# EAGLE design Main board (EAGLE 7.4.0)
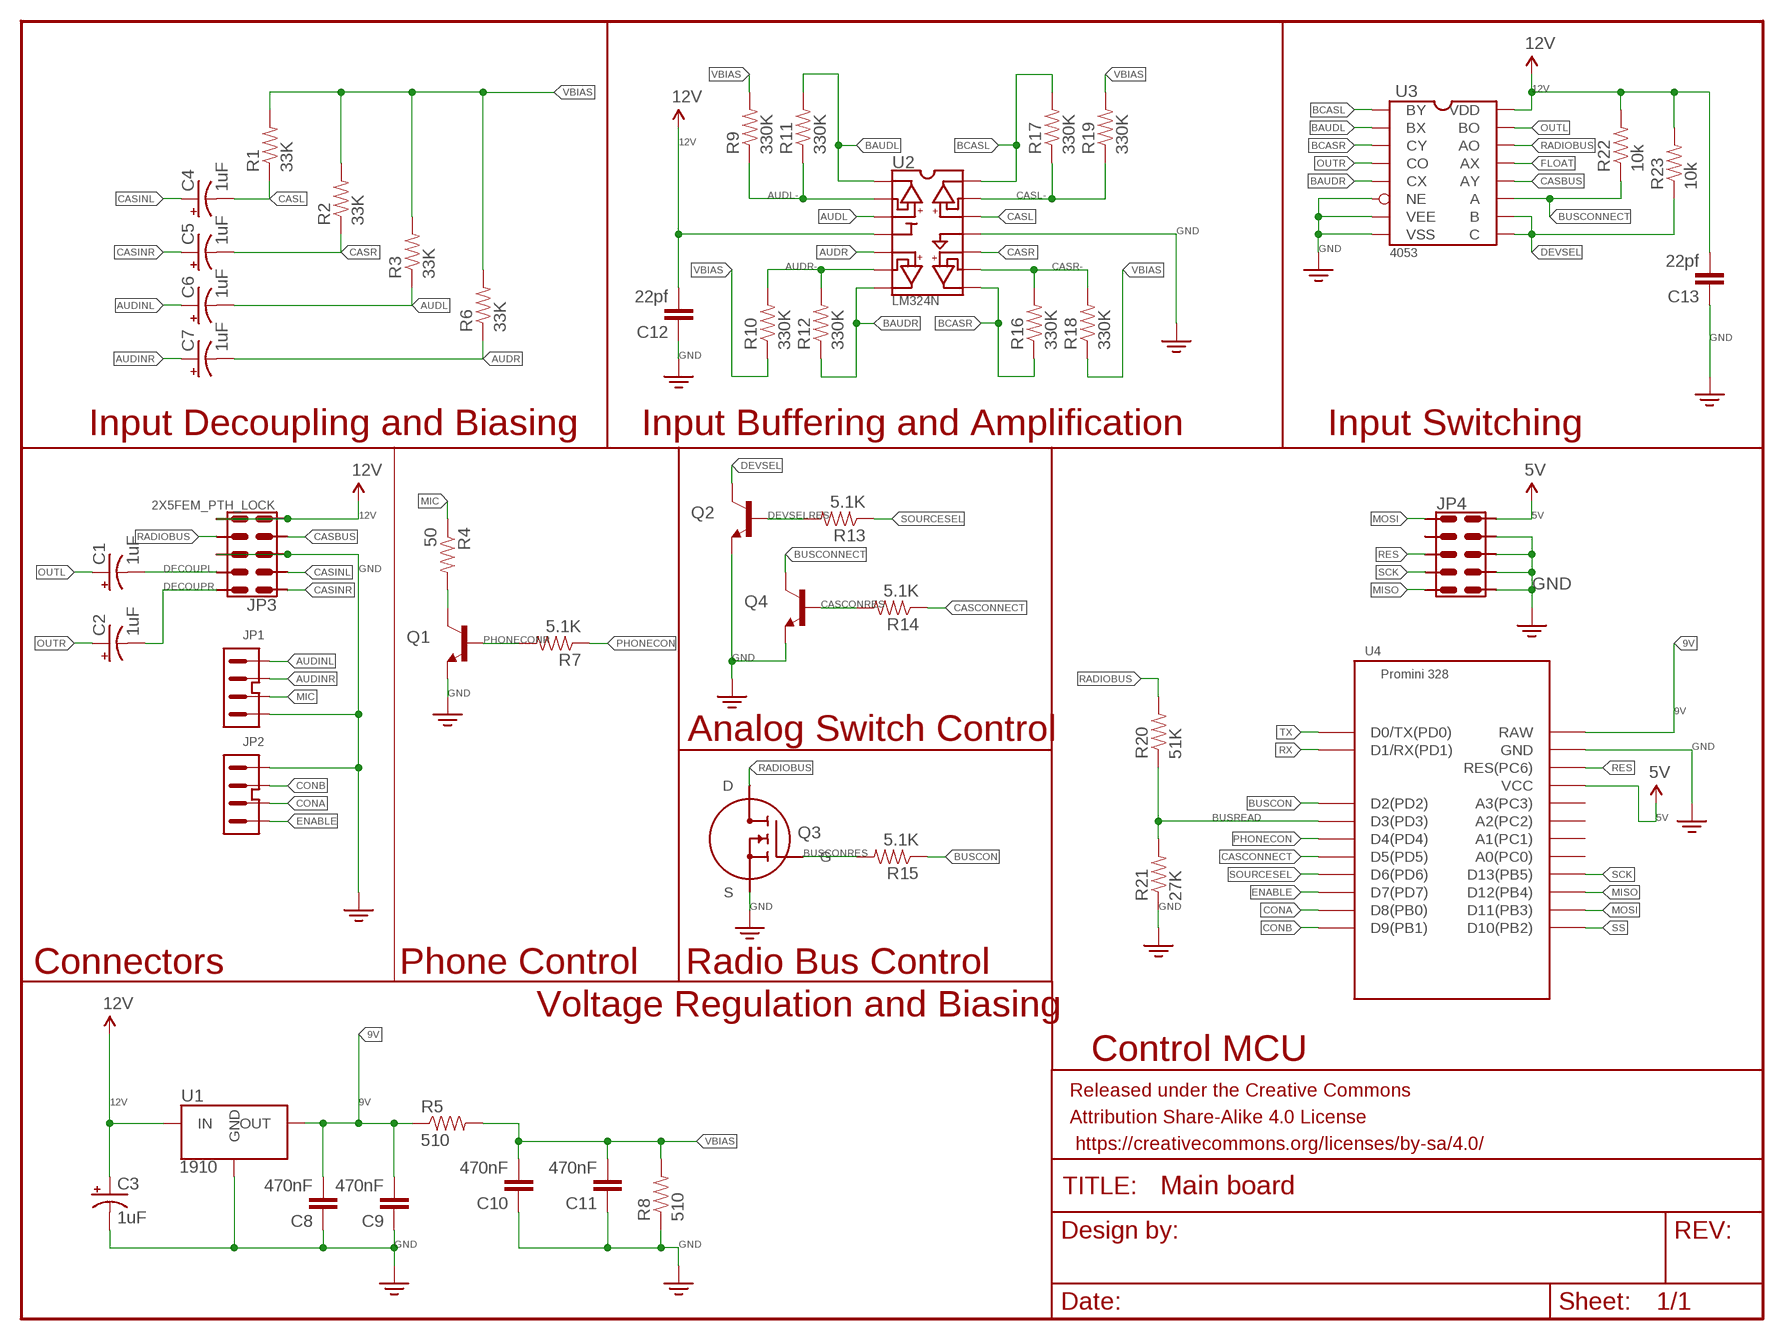
[diagram p0: schematic, sheet 1]

## Parts
C1  1uF  CAP_POLPTH2  [CPOL-RADIAL-10UF-25V]
C2  1uF  CAP_POLPTH2  [CPOL-RADIAL-10UF-25V]
C3  1uF  CAP_POLPTH2  [CPOL-RADIAL-10UF-25V]
C4  1uF  CAP_POLPTH2  [CPOL-RADIAL-10UF-25V]
C5  1uF  CAP_POLPTH2  [CPOL-RADIAL-10UF-25V]
C6  1uF  CAP_POLPTH2  [CPOL-RADIAL-10UF-25V]
C7  1uF  CAP_POLPTH2  [CPOL-RADIAL-10UF-25V]
C8  470nF  CAP0603-CAP  [0603-CAP]
C9  470nF  CAP0603-CAP  [0603-CAP]
C10  470nF  CAP0603-CAP  [0603-CAP]
C11  470nF  CAP0603-CAP  [0603-CAP]
C12  22pf  CAP0603-CAP  [0603-CAP]
C13  22pf  CAP0603-CAP  [0603-CAP]
FRAME1  FRAME-LETTERNO_PACKAGE  [DUMMY]
JP1  4PINJST  [JST-4-PTH-VERT]
JP2  4PINJST  [JST-4-PTH-VERT]
JP3  2X5FEM_PTH_LOCK  [2X5PTHFEMLOCK]
JP4  2X5FEM_PTH_LOCK  [2X5PTHFEMLOCK]
Q1  TRANSISTOR_NPNTO-92-AMMO  [TO-92-AMMO]
Q2  TRANSISTOR_NPNTO-92-AMMO  [TO-92-AMMO]
Q3  BUZ101S  [TO-220]
Q4  TRANSISTOR_NPNTO-92-AMMO  [TO-92-AMMO]
R1  33K  RESISTOR0603  [0603-RES]
R2  33K  RESISTOR0603  [0603-RES]
R3  33K  RESISTOR0603  [0603-RES]
R4  50  RESISTOR0603  [0603-RES]
R5  510  RESISTOR0603  [0603-RES]
R6  33K  RESISTOR0603  [0603-RES]
R7  5.1K  RESISTOR0603  [0603-RES]
R8  510  RESISTOR0603  [0603-RES]
R9  330K  RESISTOR0603  [0603-RES]
R10  330K  RESISTOR0603  [0603-RES]
R11  330K  RESISTOR0603  [0603-RES]
R12  330K  RESISTOR0603  [0603-RES]
R13  5.1K  RESISTOR0603  [0603-RES]
R14  5.1K  RESISTOR0603  [0603-RES]
R15  5.1K  RESISTOR0603  [0603-RES]
R16  330K  RESISTOR0603  [0603-RES]
R17  330K  RESISTOR0603  [0603-RES]
R18  330K  RESISTOR0603  [0603-RES]
R19  330K  RESISTOR0603  [0603-RES]
R20  51K  RESISTOR0603  [0603-RES]
R21  27K  RESISTOR0603  [0603-RES]
R22  10k  RESISTOR0603  [0603-RES]
R23  10k  RESISTOR0603  [0603-RES]
U1  1910  [TO-220]
U2  LM324N  [DIP14]
U3  4053  [DIP16]
U4  PROMINIV2NOFTDI  [PROMINIV2NOFTDI]

## Nets
5V: JP4.P$10 U4.VCC
9V: C8.2 C9.2 R5.1 U1.3(OUT) U4.RAW
12V: C3.1(+) C12.2 C13.2 JP3.P$5 JP3.P$6 R22.2 R23.2 U1.1(IN) U2.P$4(VCC) U3.P$16(VDD)
AUDINL: C6.1(+) JP1.1
AUDINR: C7.1(+) JP1.2
AUDL: C6.2(-) R3.1 U2.P$3(A+)
AUDL-: R9.1 R11.1 U2.P$2(A-)
AUDR: C7.2(-) R6.1 U2.P$5(B+)
AUDR-: R10.2 R12.2 U2.P$6(B-)
BAUDL: R11.2 U2.P$1(AO) U3.P$2(BX)
BAUDR: R12.1 U2.P$7(BO) U3.P$5(CX)
BCASL: R17.2 U2.P$14(DO) U3.P$1(BY)
BCASR: R16.1 U2.P$8(CO) U3.P$3(CY)
BUSCON: R15.1 U4.D2(D2(PD2))
BUSCONNECT: Q4.3(C) R22.1 U3.P$11(A)
BUSCONRES: Q3.1(G) R15.2
BUSREAD: R20.1 R21.2 U4.D3(D3(PD3))
CASBUS: JP3.P$4 U3.P$12(AY)
CASCONNECT: R14.1 U4.D5(D5(PD5))
CASCONRES: Q4.2(B) R14.2
CASINL: C4.1(+) JP3.P$2
CASINR: C5.1(+) JP3.P$1
CASL: C4.2(-) R1.1 U2.P$12(D+)
CASL-: R17.1 R19.1 U2.P$13(D-)
CASR: C5.2(-) R2.1 U2.P$10(C+)
CASR-: R16.2 R18.2 U2.P$9(C-)
CONA: JP2.3 U4.D8(D8(PB0))
CONB: JP2.2 U4.D9(D9(PB1))
DECOUPL: C1.2(-) JP3.P$9
DECOUPR: C2.2(-) JP3.P$10
DEVSEL: Q2.3(C) R23.1 U3.P$9(C) U3.P$10(B)
DEVSELRES: Q2.2(B) R13.2
ENABLE: JP2.4 U4.D7(D7(PD7))
FLOAT: U3.P$13(AX)
GND: C3.2(-) C8.1 C9.1 C10.1 C11.1 C12.1 C13.1 JP1.4 JP2.1 JP3.P$3 JP3.P$8 JP4.P$6 JP4.P$7 JP4.P$8 JP4.P$9 Q1.1(E) Q2.1(E) Q3.3(S) Q4.1(E) R8.1 R21.1 U1.2(GND) U2.P$11(GND) U3.P$6(NE) U3.P$7(VEE) U3.P$8(VSS) U4.GND1(GND) U4.GND3(GND) ; supply symbol labelled GND2
MIC: JP1.3 R4.1
MISO: JP4.P$5 U4.D12(D12(PB4))
MOSI: JP4.P$1 U4.D11(D11(PB3))
N$4: Q1.3(C) R4.2
OUTL: C1.1(+) U3.P$15(BO)
OUTR: C2.1(+) U3.P$4(CO)
PHONECON: R7.1 U4.D4(D4(PD4))
PHONECONR: Q1.2(B) R7.2
RADIOBUS: JP3.P$7 Q3.2(D) R20.2 U3.P$14(AO)
RES: JP4.P$3 U4.RES1(RES(PC6)) U4.RES3(RES(PC6))
RX: U4.D1(D1/RX(PD1))
SCK: JP4.P$4 U4.D13(D13(PB5))
SOURCESEL: R13.1 U4.D6(D6(PD6))
SS: U4.D10(D10(PB2))
TX: U4.D0(D0/TX(PD0))
VBIAS: C10.2 C11.2 R1.2 R2.2 R3.2 R5.2 R6.2 R8.2 R9.2 R10.1 R18.1 R19.2
Unconnected: JP4.P$2 U4.A0(A0(PC0)) U4.A1(A1(PC1)) U4.A2(A2(PC2)) U4.A3(A3(PC3))

## Notes on the sheet
- Input Decoupling and Biasing | Input Buffering and Amplification | Input Switching
- Analog Switch Control
- Connectors | Phone Control | Radio Bus Control
- Voltage Regulation and Biasing
- Control MCU

## Library data of the parts
C1-C7 = SparkFun-Capacitors:CAP_POL: Capacitor Polarized These are standard SMD and PTH capacitors. Normally 10uF, 47uF, and 100uF in electrolytic and tantalum varieties. Always verify the external diameter of the through hole cap, it varies with capacity, voltage, and manufacturer. The EIA devices should be standard.
C8-C13 = SparkFun-Capacitors:CAP: Capacitor Standard 0603 ceramic capacitor, and 0.1" leaded capacitor.
FRAME1 = SparkFun-Aesthetics:FRAME-LETTER: Schematic Frame Standard 8.5x11 US Letter frame; DESIGNER: Nobody; VERSION: v01
JP1 JP2 = GM cassette faker:4PINJST
JP3 JP4 = Jordan Connectors:2X5
Q1 Q2 Q4 = SparkFun-DiscreteSemi:TRANSISTOR_NPN: Generic NPN BJT MMBT2222A - TRANS-08049 (SOT-23, 1A 40V) MPSA42 - TRANS-09116 (SOT-23, 500mA 300V) MMBT5088LT1G - TRANS-11160 (SOT-23, 50 mA 30V) BC547 - COM-08928 <http://www.sparkfun.com/products/8928> (TO-92 45V 100mA) (1.Collector 2.Base 3.Emitter) 2N3904 - COM-00521 <http://www.sparkfun.com/products/521> (TO-92 40V 200mA) (1.Emitter 2.Base 3.Collector) P2N2222A - COM-12852 <http://www.sparkfun.com/products/12852> (TO-92 40V 600mA) (1.Collector 2.Base 3.Emitter)
Q3 = GM cassette faker:BUZ101S: BUZ101S 55v 22A .06OHM on
R1-R23 = SparkFun-Resistors:RESISTOR: Resistor Basic schematic elements and footprints for 0603, 1206, and PTH resistors.
U1 = GM cassette faker:1910: NTE1910 9v 1A LDO
U2 = GM cassette faker:LM324N
U3 = GM cassette faker:4053
U4 = GM cassette faker:PROMINIV2NOFTDI

## Board
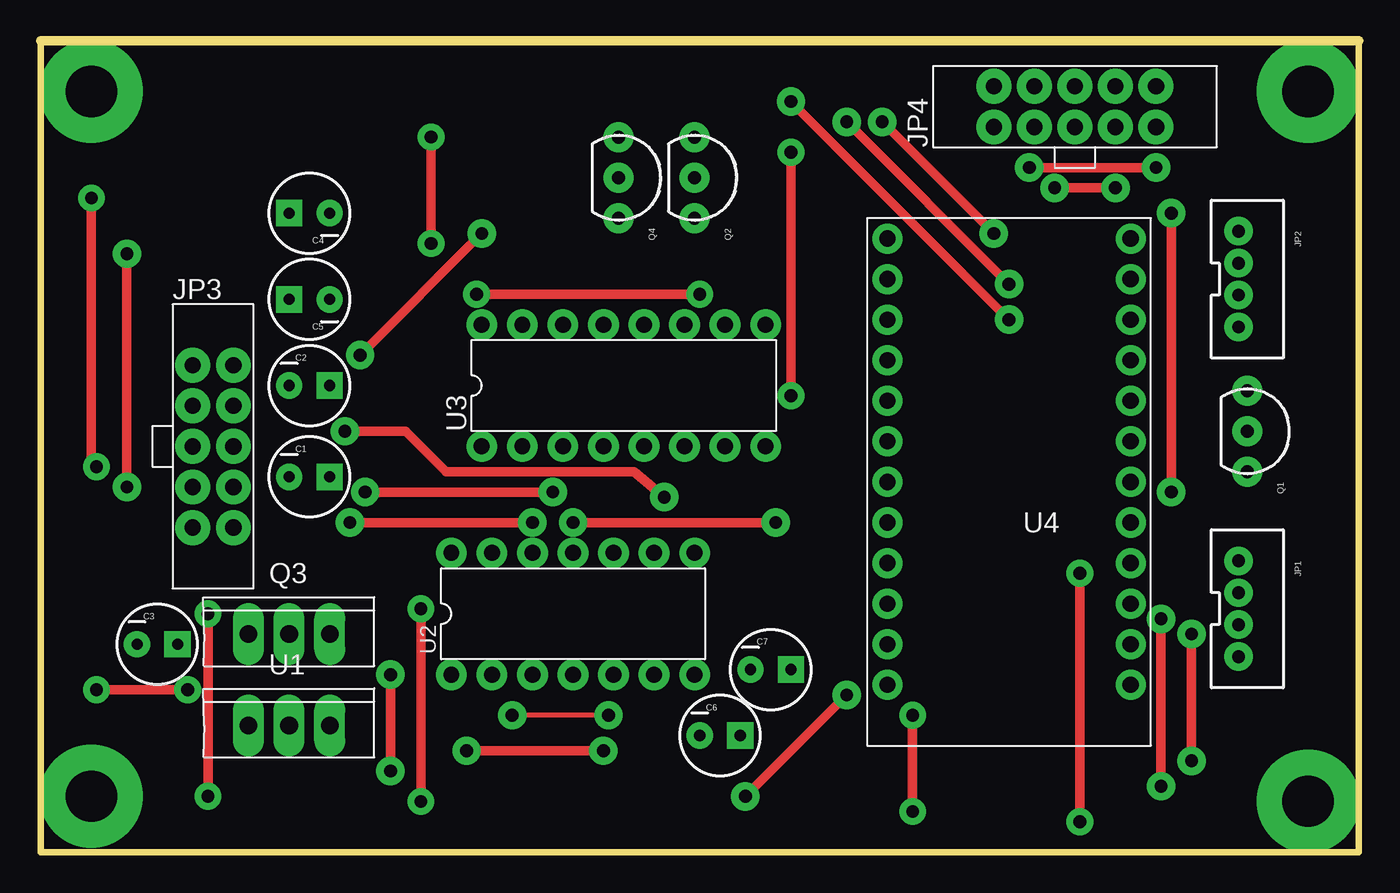
[diagram p1: board, top side]
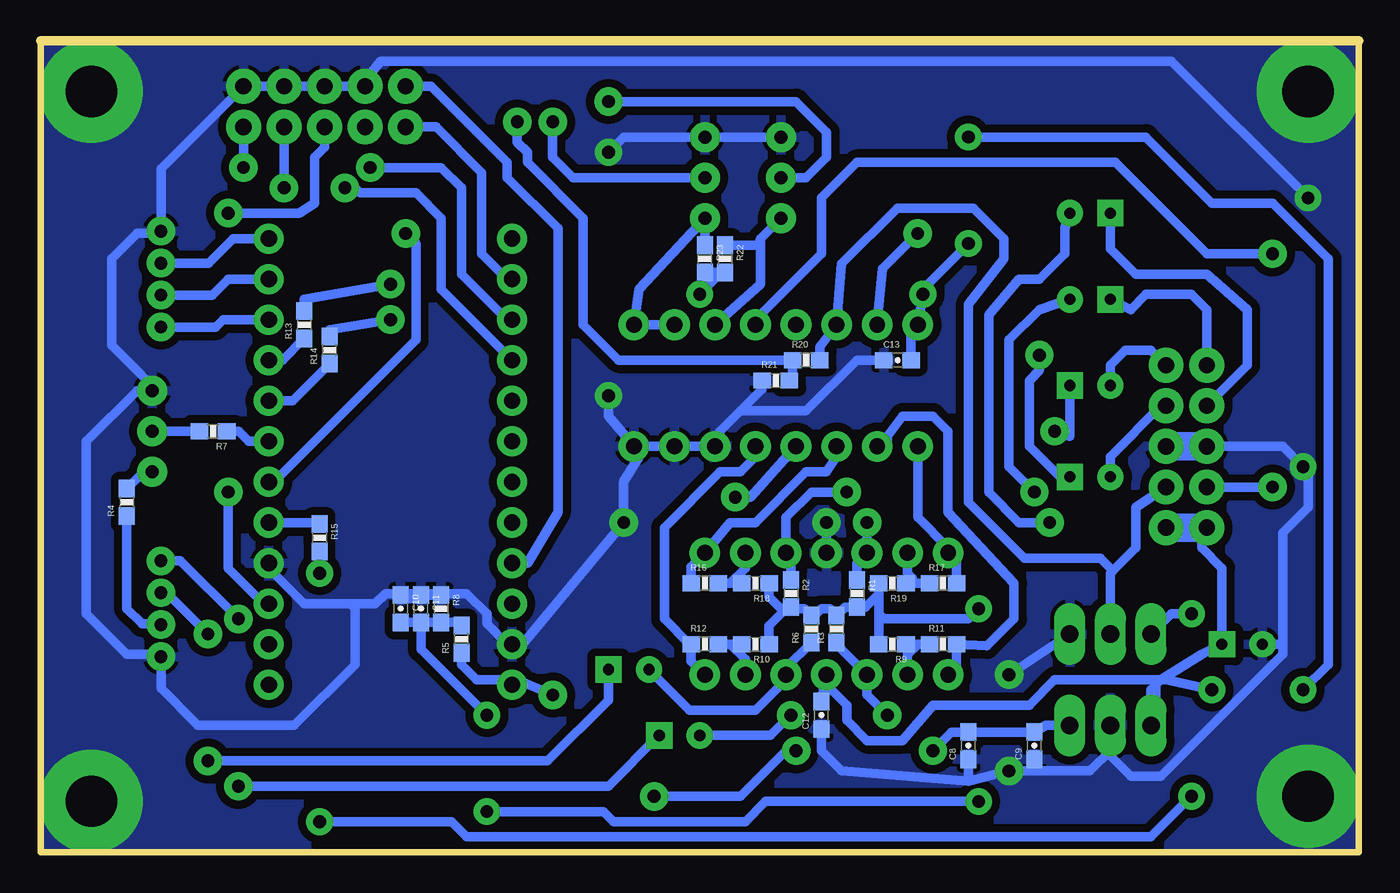
[diagram p2: board, bottom side, seen from below]

Size 82.55 x 50.8 mm. Coordinates in mm from the lower left corner, seen from the top.
Outline: 0,0 0,50.8 82.55,50.8 82.55,0 0,0
Copper layers (1*16): Top 0.035mm / dielectric 1.5mm / Bottom 0.035mm
Design rules "default *": minimum track width 10mil, minimum drill 24mil, track to track 20mil, track to pad 20mil, pad to pad 20mil, via to via 20mil, smd to smd 0mil, copper to edge 0.002540625mm, drill to drill 1mil, minimum pad ring 10mil, minimum via ring 8mil, stop-mask expansion 4mil, vias tented up to drill 0mil, thermal gap 10mil

### Footprints (pad centres in the part's own frame; a part is rotated, then mirrored left to right if it is on the bottom)
CPOL-RADIAL-10UF-25V = drill 0.7 pad 1.651 square: 1 1.27,0 | drill 0.7 pad 1.651: 2 -1.27,0
0603-CAP = smd 1.1 x 1: 1 -0.85,0; 2 0.85,0
JST-4-PTH-VERT = drill 0.8 pad 1.778: 1 -3,-0.55; 2 -1,-0.55; 3 1,-0.55; 4 3,-0.55
2X5PTHFEMLOCK = drill 1.016 pad 2.184: P$1 -1.27,5.08; P$2 -1.27,2.54; P$3 -1.27,0; P$4 -1.27,-2.54; P$5 -1.27,-5.08; P$6 1.27,-5.08; P$7 1.27,-2.54; P$8 1.27,0; P$9 1.27,2.54; P$10 1.27,5.08
TO-92-AMMO = drill 0.813 pad 1.88: 1 -2.54,0; 2 0,0; 3 2.54,0
TO-220 = drill 1.1 pad 1.93 long: 1 0,2.54; 2 0,0; 3 0,-2.54
0603-RES = smd 1.1 x 1: 1 -0.85,0; 2 0.85,0
DIP14 = drill 1 pad 1.93: P$1 -3.81,7.62; P$2 -3.81,5.08; P$3 -3.81,2.54; P$4 -3.81,0; P$5 -3.81,-2.54; P$6 -3.81,-5.08; P$7 -3.81,-7.62; P$8 3.81,-7.62; P$9 3.81,-5.08; P$10 3.81,-2.54; P$11 3.81,0; P$12 3.81,2.54; P$13 3.81,5.08; P$14 3.81,7.62
DIP16 = drill 1 pad 1.93: P$1 -3.81,8.89; P$2 -3.81,6.35; P$3 -3.81,3.81; P$4 -3.81,1.27; P$5 -3.81,-1.27; P$6 -3.81,-3.81; P$7 -3.81,-6.35; P$8 -3.81,-8.89; P$9 3.81,-8.89; P$10 3.81,-6.35; P$11 3.81,-3.81; P$12 3.81,-1.27; P$13 3.81,1.27; P$14 3.81,3.81; P$15 3.81,6.35; P$16 3.81,8.89
PROMINIV2NOFTDI = drill 1.016 pad 1.88: A0 7.62,-7.62; A1 7.62,-5.08; A2 7.62,-2.54; A3 7.62,0; D0 -7.62,10.16; D1 -7.62,7.62; D2 -7.62,0; D3 -7.62,-2.54; D4 -7.62,-5.08; D5 -7.62,-7.62; D6 -7.62,-10.16; D7 -7.62,-12.7; D8 -7.62,-15.24; D9 -7.62,-17.78; D10 7.62,-17.78; D11 7.62,-15.24; D12 7.62,-12.7; D13 7.62,-10.16; GND1 -7.62,2.54; GND3 7.62,7.62; RAW 7.62,10.16; RES1 -7.62,5.08; RES3 7.62,5.08; VCC 7.62,2.54

### Placement (x,y rotation side)
C1  16.83,23.5 0 top
C2  16.83,29.21 0 top
C3  7.3,13.02 0 top
C4  16.83,40.01 180 top
C5  16.83,34.61 180 top
C6  42.54,7.3 0 top
C7  45.72,11.43 0 top
C8  24.45,6.67 90 bottom
C9  20.32,6.67 90 bottom
C10  60.01,15.24 270 bottom
C11  58.74,15.24 270 bottom
C12  33.66,8.57 90 bottom
C13  28.89,30.8 0 bottom
FRAME1  -37.47,66.04 0 top  (outside the outline)
JP1  75.56,15.24 270 top
JP2  75.56,35.88 270 top
JP3  10.79,25.4 0 top
JP4  64.77,46.67 90 top
Q1  75.56,26.35 270 top
Q2  40.96,42.23 270 top
Q3  15.56,13.65 90 top
Q4  36.2,42.23 270 top
R1  31.43,16.19 270 bottom
R2  35.56,16.19 270 bottom
R3  32.7,13.97 90 bottom
R4  77.15,21.91 90 bottom
R5  56.2,13.34 90 bottom
R6  34.29,13.97 90 bottom
R7  71.75,26.35 180 bottom
R8  57.47,15.24 270 bottom
R9  29.21,13.02 180 bottom
R10  37.78,13.02 180 bottom
R11  26.04,13.02 0 bottom
R12  40.96,13.02 0 bottom
R13  66.04,33.02 90 bottom
R14  64.45,31.43 90 bottom
R15  65.09,19.68 270 bottom
R16  40.96,16.83 0 bottom
R17  26.04,16.83 0 bottom
R18  37.78,16.83 180 bottom
R19  29.21,16.83 180 bottom
R20  34.61,30.8 0 bottom
R21  36.51,29.53 0 bottom
R22  39.69,37.15 270 bottom
R23  40.96,37.15 270 bottom
U1  15.56,7.94 90 top
U2  33.34,14.92 90 top
U3  36.51,29.21 90 top
U4  60.64,20.64 180 top

### Tracks (layer width: path | path; a pad name or v marks a point on that pad's centre or on a via)
5V
  Bottom 0.61: JP4.P$10 58.1,47.94 53.34,43.18 53.34,42.23 50.16,39.05 50.16,21.27 52.07,18.1 U4.VCC
9V  (via drill 0.8 pad 1.78)
  Top 0.61: v26.67,6.35 v35.24,6.35 | v44.13,3.49 v50.48,9.84
  Bottom 0.61: R5.1 56.2,11.75 55.24,10.79 53.34,10.79 U4.RAW 52.7,10.79 v50.48,9.84 | U1.3 19.58,7.94 C9.2 C8.2 25.5,7.52 v26.67,6.35 | v35.24,6.35 35.88,6.35 38.73,3.49 v44.13,3.49
12V  (via drill 0.8 pad 1.68)
  Top 0.61: v41.27,34.92 v27.3,34.92 | v24.45,38.1 v24.45,44.77 | v3.49,10.16 v9.21,10.16
  Bottom 0.61: C13.2 28.04,32.28 U3.P$16 v27.3,34.92 27.3,35.24 v24.45,38.1 | C12.2 U2.P$4 33.34,10.48 32.07,9.21 32.07,8.26 30.8,6.99 28.57,6.99 26.67,9.21 20.64,9.21 19.05,10.79 12.38,10.79 | 12.38,10.79 9.84,12.38 C3.1 8.89,13.02 8.57,13.34 8.57,17.78 9.84,19.05 9.84,20.32 | U1.1 13.02,9.53 | 13.02,9.53 13.02,10.16 12.38,10.79 | R23.2 R22.2 40.22,35.98 v41.27,34.92 | v24.45,44.77 13.34,44.77 9.21,40.64 5.4,40.64 1.9,37.15 1.9,11.75 v3.49,10.16 | v9.21,10.16 12.07,10.79 12.7,10.79 12.7,9.53 13.02,9.53
  Bottom 1.778: JP3.P$6 9.84,20.32 JP3.P$5
AUDINL  (via drill 0.8 pad 1.78)
  Top 0.61: v70.17,14.61 v70.17,4.13
  Bottom 0.61: JP1.1 73.8,18.24 v70.17,14.61 | v70.17,4.13 46.99,4.13 C6.1
AUDINR  (via drill 0.8 pad 1.78)
  Top 0.61: v72.07,13.65 v72.07,5.71
  Bottom 0.61: JP1.2 74.66,16.24 v72.07,13.65 | v72.07,5.71 50.8,5.71 46.99,9.53 C7.1
AUDL  (via drill 0.8 pad 1.78)
  Top 0.305: v35.56,8.57 v29.53,8.57
  Bottom 0.61: R3.1 32.7,13.02 U2.P$3 30.8,9.84 v29.53,8.57 | C6.2 36.83,7.3 v35.56,8.57
AUDL-
  Bottom 0.61: U2.P$2 28.26,12.38 27.62,13.02 R9.1 R11.1
AUDR
  Bottom 0.61: R6.1 35.88,11.53 U2.P$5 35.88,10.79 37.78,8.89 41.91,8.89 C7.2
AUDR-
  Bottom 0.61: R12.2 39.37,13.02 | 39.37,13.02 R10.2 | U2.P$6 38.42,12.06 39.37,13.02
BAUDL
  Bottom 0.61: U2.P$1 25.19,11.64 R11.2 23.28,12.91 21.59,14.61 21.59,16.83 25.72,21.27 25.72,26.35 26.67,27.3 28.57,27.3 29.53,26.04 29.53,25.72 U3.P$2
BAUDR
  Bottom 0.61: U2.P$7 41.81,11.96 R12.1 41.91,13.02 43.5,14.61 43.5,20.32 40,23.81 38.73,23.81 37.78,24.77 U3.P$5
BCASL
  Bottom 0.61: U3.P$1 27.62,20.95 25.72,19.05 U2.P$14 25.19,18.2 R17.2
BCASR
  Bottom 0.61: R16.1 41.81,17.88 U2.P$8 39.37,20.64 37.78,20.64 34.61,23.81 33.34,23.81 32.7,24.77 U3.P$3
BUSCON
  Bottom 0.61: U4.D2 65.19,20.64 R15.1
BUSCONNECT
  Bottom 0.61: U3.P$11 37.46,35.56 37.46,38.42 | 37.46,38.42 Q4.3 | R22.1 37.57,38 37.46,38.42
BUSCONRES  (via drill 0.8 pad 1.68)
  Top 0.61: v65.09,17.46 v65.09,1.91 | v10.48,3.49 v10.48,14.92
  Bottom 0.61: R15.2 v65.09,17.46 | v65.09,1.91 56.83,1.91 55.88,0.95 13.02,0.95 v10.48,3.49 | v10.48,14.92 11.75,14.92 Q3.1
BUSREAD  (via drill 0.8 pad 1.78)
  Top 0.61: v59.69,38.73 v52.7,45.72
  Bottom 0.61: R21.2 35.46,29.73 R20.1 46.35,30.8 48.58,33.02 48.58,39.69 52.07,43.18 52.07,43.81 52.7,44.45 v52.7,45.72 | U4.D3 67.94,23.18 59.05,32.07 59.05,38.1 v59.69,38.73
CASBUS  (via drill 0.8 pad 1.78)
  Top 0.61: v5.4,22.86 v5.4,37.47
  Bottom 0.61: JP3.P$4 v5.4,22.86 | v5.4,37.47 9.52,37.47 15.24,43.18 31.43,43.18 33.66,40.96 33.66,37.47 37.46,33.66 U3.P$12
CASCONNECT
  Bottom 0.61: U4.D5 66.78,28.26 R14.1
CASCONRES  (via drill 0.8 pad 1.78)
  Top 0.61: v60.64,33.34 v46.99,46.99
  Bottom 0.61: R14.2 64.45,32.7 v60.64,33.34 | v46.99,46.99 35.24,46.99 33.34,45.09 33.34,43.5 34.61,42.23 Q4.2
CASINL
  Bottom 0.61: JP3.P$2 6.98,30.48 6.98,33.97 9.52,36.2 13.97,36.2 15.56,37.78 C4.1
CASINR
  Bottom 0.61: JP3.P$1 9.52,33.97 10.48,34.92 13.34,34.92 14.29,33.97 C5.1
CASL  (via drill 0.8 pad 1.78)
  Top 0.61: v19.37,20.64 v30.8,20.64
  Bottom 0.61: R1.1 31.43,18.1 U2.P$12 v30.8,20.64 | C4.2 18.41,39.05 18.41,37.47 20,35.88 21.27,35.88 23.18,33.66 23.18,22.54 21.27,20.64 v19.37,20.64
CASL-
  Bottom 0.61: R17.1 R19.1 28.26,16.83 27.94,17.14 28.26,17.46 U2.P$13
CASR  (via drill 0.8 pad 1.78)
  Top 0.61: v20.32,22.54 v32.07,22.54
  Bottom 0.61: R2.1 35.56,18.1 U2.P$10 35.88,20.95 34.29,22.54 v32.07,22.54 | C5.2 20,33.97 21.91,32.07 21.91,24.13 v20.32,22.54
CASR-
  Bottom 0.61: R18.2 39.37,16.83 | 39.37,16.83 R16.2 | U2.P$9 38.42,17.78 39.37,16.83
CONA
  Bottom 0.61: JP2.3 71.8,34.88 70.8,35.88 U4.D8
CONB
  Bottom 0.61: JP2.2 72.02,36.88 70.48,38.42 U4.D9
DECOUPL
  Bottom 0.61: C1.2 15.56,24.77 12.38,27.94 JP3.P$9
DECOUPR
  Bottom 0.61: JP3.P$10 13.02,31.43 14.61,31.43 15.56,30.48 C2.2
DEVSEL
  Bottom 0.61: U3.P$10 U3.P$9 45.08,35.24 Q2.3 R23.1
DEVSELRES  (via drill 0.8 pad 1.78)
  Top 0.61: v50.48,45.72 v60.64,35.56
  Bottom 0.61: Q2.2 49.21,42.23 50.48,43.5 v50.48,45.72 | v60.64,35.56 66.04,34.61 R13.2
ENABLE
  Bottom 0.61: JP2.4 71.58,32.88 71.12,33.34 U4.D7
GND  (via drill 0.8 pad 1.68, 0.8 pad 1.78, 3.2 pad 6.45)
  Top 0.61: v33.34,20.64 v46.04,20.64 | v21.91,11.11 v21.91,5.08 | v46.99,43.81 v46.99,28.57 | v3.17,40.96 3.17,24.45 v3.49,24.13
  Bottom 0.61: U3.P$8 U3.P$7 U3.P$6 40,26.35 38.73,27.62 | C13.1 31.43,30.8 34.61,27.62 38.73,27.62 | R21.1 37.36,29 38.73,27.62 | JP4.P$9 62.55,47.94 | 62.55,47.94 JP4.P$8 JP4.P$7 JP4.P$6 75.02,42.78 JP2.1 75.16,38.73 76.52,38.73 78.11,37.15 78.11,31.75 75.56,29.21 Q1.1 76.52,28.89 79.69,25.72 79.69,14.92 77.15,12.38 75.16,12.38 JP1.4 75.02,10.24 72.71,7.94 66.67,7.94 62.86,11.75 62.86,15.24 63.18,15.56 | U3.P$8 45.08,24.77 46.04,23.18 v46.04,20.64 52.39,13.02 U4.GND3 53.34,13.02 54.61,14.29 54.61,14.92 55.88,16.19 59.05,16.19 | U1.2 15.56,6.35 | 15.56,6.35 15.56,6.03 14.29,4.76 12.38,4.76 4.76,12.38 4.76,13.02 | 4.76,13.02 4.76,20 3.17,21.59 3.17,23.81 v3.49,24.13 4.76,25.4 JP3.P$3 | C3.2 4.76,13.02 | Q3.3 v21.91,11.11 | 20.32,5.08 v21.91,5.08 24.45,4.45 | 20.32,5.08 16.83,5.08 15.56,6.35 | C12.1 33.66,6.35 32.38,5.08 24.45,4.45 | R8.1 C11.1 C10.1 59.9,16.19 59.05,16.19 | C9.1 20.32,5.08 | C8.1 24.45,4.45 | Q4.1 Q2.1 46.04,44.77 v46.99,43.81 | v46.99,28.57 46.99,27.3 U3.P$8 | U2.P$11 v33.34,20.64 | U4.GND1 68.26,17.78 66.04,15.56 63.18,15.56 | 63.18,15.56 61.59,15.56 60.96,16.19 59.69,16.19 59.37,15.88 59.05,16.19 | 62.55,47.94 61.28,49.53 11.75,49.53 v3.17,40.96
  Bottom 1.778: JP3.P$3 JP3.P$8
  other vias: 3.17,47.62 3.17,3.49 79.38,3.17 79.38,47.62
  pour Bottom: 0,50.8 0,0 82.55,0 82.55,50.8
MIC
  Bottom 0.61: R4.1 77.15,15.24 76.2,14.29 75.06,14.29 JP1.3
MISO  (via drill 0.8 pad 1.78)
  Top 0.61: v61.91,42.86 v69.85,42.86
  Bottom 0.61: U4.D12 53.34,33.34 56.2,36.2 56.2,41.59 57.47,42.86 v61.91,42.86 | v69.85,42.86 JP4.P$5
MOSI
  Bottom 0.61: U4.D11 53.34,35.88 54.93,37.47 54.93,42.55 57.78,45.4 JP4.P$1
N$4
  Bottom 0.61: Q1.3 76.1,23.81 R4.2
OUTL  (via drill 0.8 pad 1.78)
  Top 0.61: v27.62,38.73 v20,31.11
  Bottom 0.61: C1.1 18.73,23.5 20.64,25.4 20.64,29.53 20,30.16 v20,31.11 | U3.P$15 29.85,36.51 v27.62,38.73
OUTR  (via drill 0.8 pad 1.78)
  Top 0.61: v19.05,26.35 22.86,26.35 25.4,23.81 37.15,23.81 v39.05,22.23
  Bottom 0.61: C2.1 18.1,26.04 v19.05,26.35 | v39.05,22.23 38.1,22.23 U3.P$4
PHONECON
  Bottom 0.61: U4.D4 69.53,25.72 70.17,26.35 R7.1
PHONECONR
  Bottom 0.61: R7.2 Q1.2
RADIOBUS
  Bottom 0.61: R20.2 33.76,31.65 U3.P$14 32.38,36.83 28.89,40.32 24.13,40.32 22.23,38.42 22.23,37.15 24.45,34.29 24.45,21.91 20.96,18.41 16.19,18.41 15.4,17.62 | JP3.P$7 13.97,21.59 13.97,19.05 15.4,17.62 | 15.4,17.62 15.56,17.46 Q3.2
RES  (via drill 0.8 pad 1.78)
  Top 0.61: v70.8,22.54 v70.8,40.01
  Bottom 0.61: U4.RES1 68.58,15.56 70.8,17.78 v70.8,22.54 | JP4.P$3 64.77,44.13 65.41,43.5 65.41,40.64 66.36,40.01 v70.8,40.01
SCK  (via drill 0.8 pad 1.78)
  Top 0.61: v63.5,41.59 v67.31,41.59
  Bottom 0.61: v67.31,41.59 JP4.P$4 | U4.D13 57.47,35.24 57.47,39.69 59.05,41.27 62.55,41.27 62.86,41.59 v63.5,41.59
SOURCESEL
  Bottom 0.61: U4.D6 67.41,30.8 R13.1
VBIAS  (via drill 0.8 pad 1.68)
  Top 0.61: v23.81,15.24 v23.81,3.17 | v54.61,2.54 v54.61,8.57
  Bottom 0.61: R9.2 30.06,14.92 | 30.06,14.92 30.06,16.19 | 30.06,16.19 R19.2 | R1.2 31.23,15.34 | R18.1 36.93,15.98 36.2,15.24 35.88,15.24 | 35.88,15.24 35.34,15.24 | 35.34,15.24 R2.2 | R10.1 36.93,14.19 35.88,15.24 | R1.2 30.91,15.34 30.06,16.19 | 35.34,15.24 34.71,15.24 R6.2 34.07,14.82 33.66,15.24 33.12,15.24 R3.2 32.18,15.34 R1.2 | C11.2 C10.2 | C11.2 R8.2 56.31,14.39 R5.2 | v23.81,15.24 24.45,14.61 29.85,14.61 29.85,14.71 30.06,14.92 | v23.81,3.17 37.15,3.17 38.42,1.91 46.67,1.91 47.31,2.54 v54.61,2.54 | v54.61,8.57 58.74,12.7 C11.2